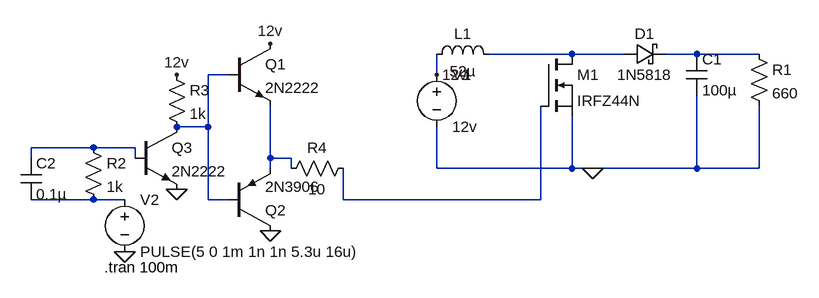
[diagram p0: schematic boost_converter.asc]
boost_converter.asc, the LTspice schematic file:
Version 4
SHEET 1 1204 680
WIRE 304 80 176 80
WIRE 384 80 304 80
WIRE 496 80 448 80
WIRE 592 80 496 80
WIRE -224 112 -256 112
WIRE 96 112 96 80
WIRE -256 192 -256 112
WIRE -256 192 -304 192
WIRE -432 224 -528 224
WIRE -368 224 -432 224
WIRE -528 240 -528 224
WIRE -368 240 -368 224
WIRE -160 240 -160 160
WIRE -128 240 -160 240
WIRE -160 256 -160 240
WIRE -128 256 -128 240
WIRE 96 256 96 192
WIRE 304 256 304 176
WIRE 304 256 96 256
WIRE 336 256 304 256
WIRE 496 256 496 144
WIRE 496 256 336 256
WIRE 592 256 592 160
WIRE 592 256 496 256
WIRE -432 304 -528 304
WIRE -384 304 -432 304
WIRE -256 304 -256 192
WIRE -224 304 -256 304
WIRE -48 304 -48 256
WIRE 256 304 256 160
WIRE 256 304 -48 304
FLAG 336 256 0
FLAG -384 384 0
FLAG 96 112 12v
FLAG -160 352 0
FLAG -160 64 12v
FLAG -304 288 0
FLAG -304 112 12v
SYMBOL voltage 96 96 R0
WINDOW 123 0 0 Left 0
WINDOW 39 0 0 Left 0
SYMATTR InstName V1
SYMATTR Value 12v
SYMBOL ind 80 96 R270
WINDOW 0 32 56 VTop 2
WINDOW 3 5 56 VBottom 2
SYMATTR InstName L1
SYMATTR Value 52µ
SYMBOL nmos 256 80 R0
SYMATTR InstName M1
SYMATTR Value IRFZ44N
SYMBOL schottky 384 96 R270
WINDOW 0 32 32 VTop 2
WINDOW 3 0 32 VBottom 2
SYMATTR InstName D1
SYMATTR Value 1N5818
SYMATTR Description Diode
SYMATTR Type diode
SYMBOL cap 480 80 R0
SYMATTR InstName C1
SYMATTR Value 100µ
SYMBOL res 576 64 R0
SYMATTR InstName R1
SYMATTR Value 660
SYMBOL voltage -384 288 R0
WINDOW 123 0 0 Left 0
WINDOW 39 0 0 Left 0
SYMATTR InstName V2
SYMATTR Value PULSE(5 0 1m 1n 1n 5.3u 16u)
SYMBOL npn -224 64 R0
SYMATTR InstName Q1
SYMATTR Value 2N2222
SYMBOL pnp -224 352 M180
SYMATTR InstName Q2
SYMATTR Value 2N3906
SYMBOL npn -368 192 R0
SYMATTR InstName Q3
SYMATTR Value 2N2222
SYMBOL res -448 208 R0
SYMATTR InstName R2
SYMATTR Value 1k
SYMBOL res -320 96 R0
SYMATTR InstName R3
SYMATTR Value 1k
SYMBOL res -32 240 R90
WINDOW 0 0 56 VBottom 2
WINDOW 3 32 56 VTop 2
SYMATTR InstName R4
SYMATTR Value 10
SYMBOL cap -544 240 R0
SYMATTR InstName C2
SYMATTR Value 0.1µ
TEXT -416 408 Left 2 !.tran 100m

The netlist it stands for:
* boost_converter.asc
V1 12v 0 12v
L1 12v N001 52µ
M1 N001 N007 0 0 IRFZ44N
D1 N001 N002 1N5818
C1 N002 0 100µ
R1 N002 0 660
V2 N006 0 PULSE(5 0 1m 1n 1n 5.3u 16u)
Q1 12v N003 N005 0 2N2222
Q2 0 N003 N005 0 2N3906
Q3 N003 N004 0 0 2N2222
R2 N004 N006 1k
R3 12v N003 1k
R4 N007 N005 10
C2 N004 N006 0.1µ
.model D D
.lib standard.dio
.model NPN NPN
.model PNP PNP
.lib standard.bjt
.model NMOS NMOS
.model PMOS PMOS
.lib standard.mos
.tran 100m
.backanno
.end